# Altium schematic sheet Board.SchDoc: Main MCU
size A3; ApprovedBy: Diogo Gomes; CheckedBy: Bruno, Candido, Pedro; Author: João Vieira; CompanyName: LART; DrawnBy: João Vieira; Organization: LART; Address1: Morro do lena; Address2: Alto Do Vieiro; Address3: APT 4163, Building D; Revision: v1.4.2; SheetNumber: 4; SheetTotal: 12; ProjectTitle: Autonomous Control Unit; CheckedBy1: G. Candido; CheckedBy2: F. Chen; CheckedBy3: P. Ferreira; CheckedBy4: B. Vicente; CheckedBy5: _; CheckedBy6: _; CheckedBy7: _; CHK_APP_DATE: --/--/--; DSN_APP_DATE: --/--/--; ENG_APP_DATE: --/--/--; Summary: The Main Microcontroller that powers the entire ACU; version_tag: 1.4.2; ImagePath: C:\Users\micron\Desktop
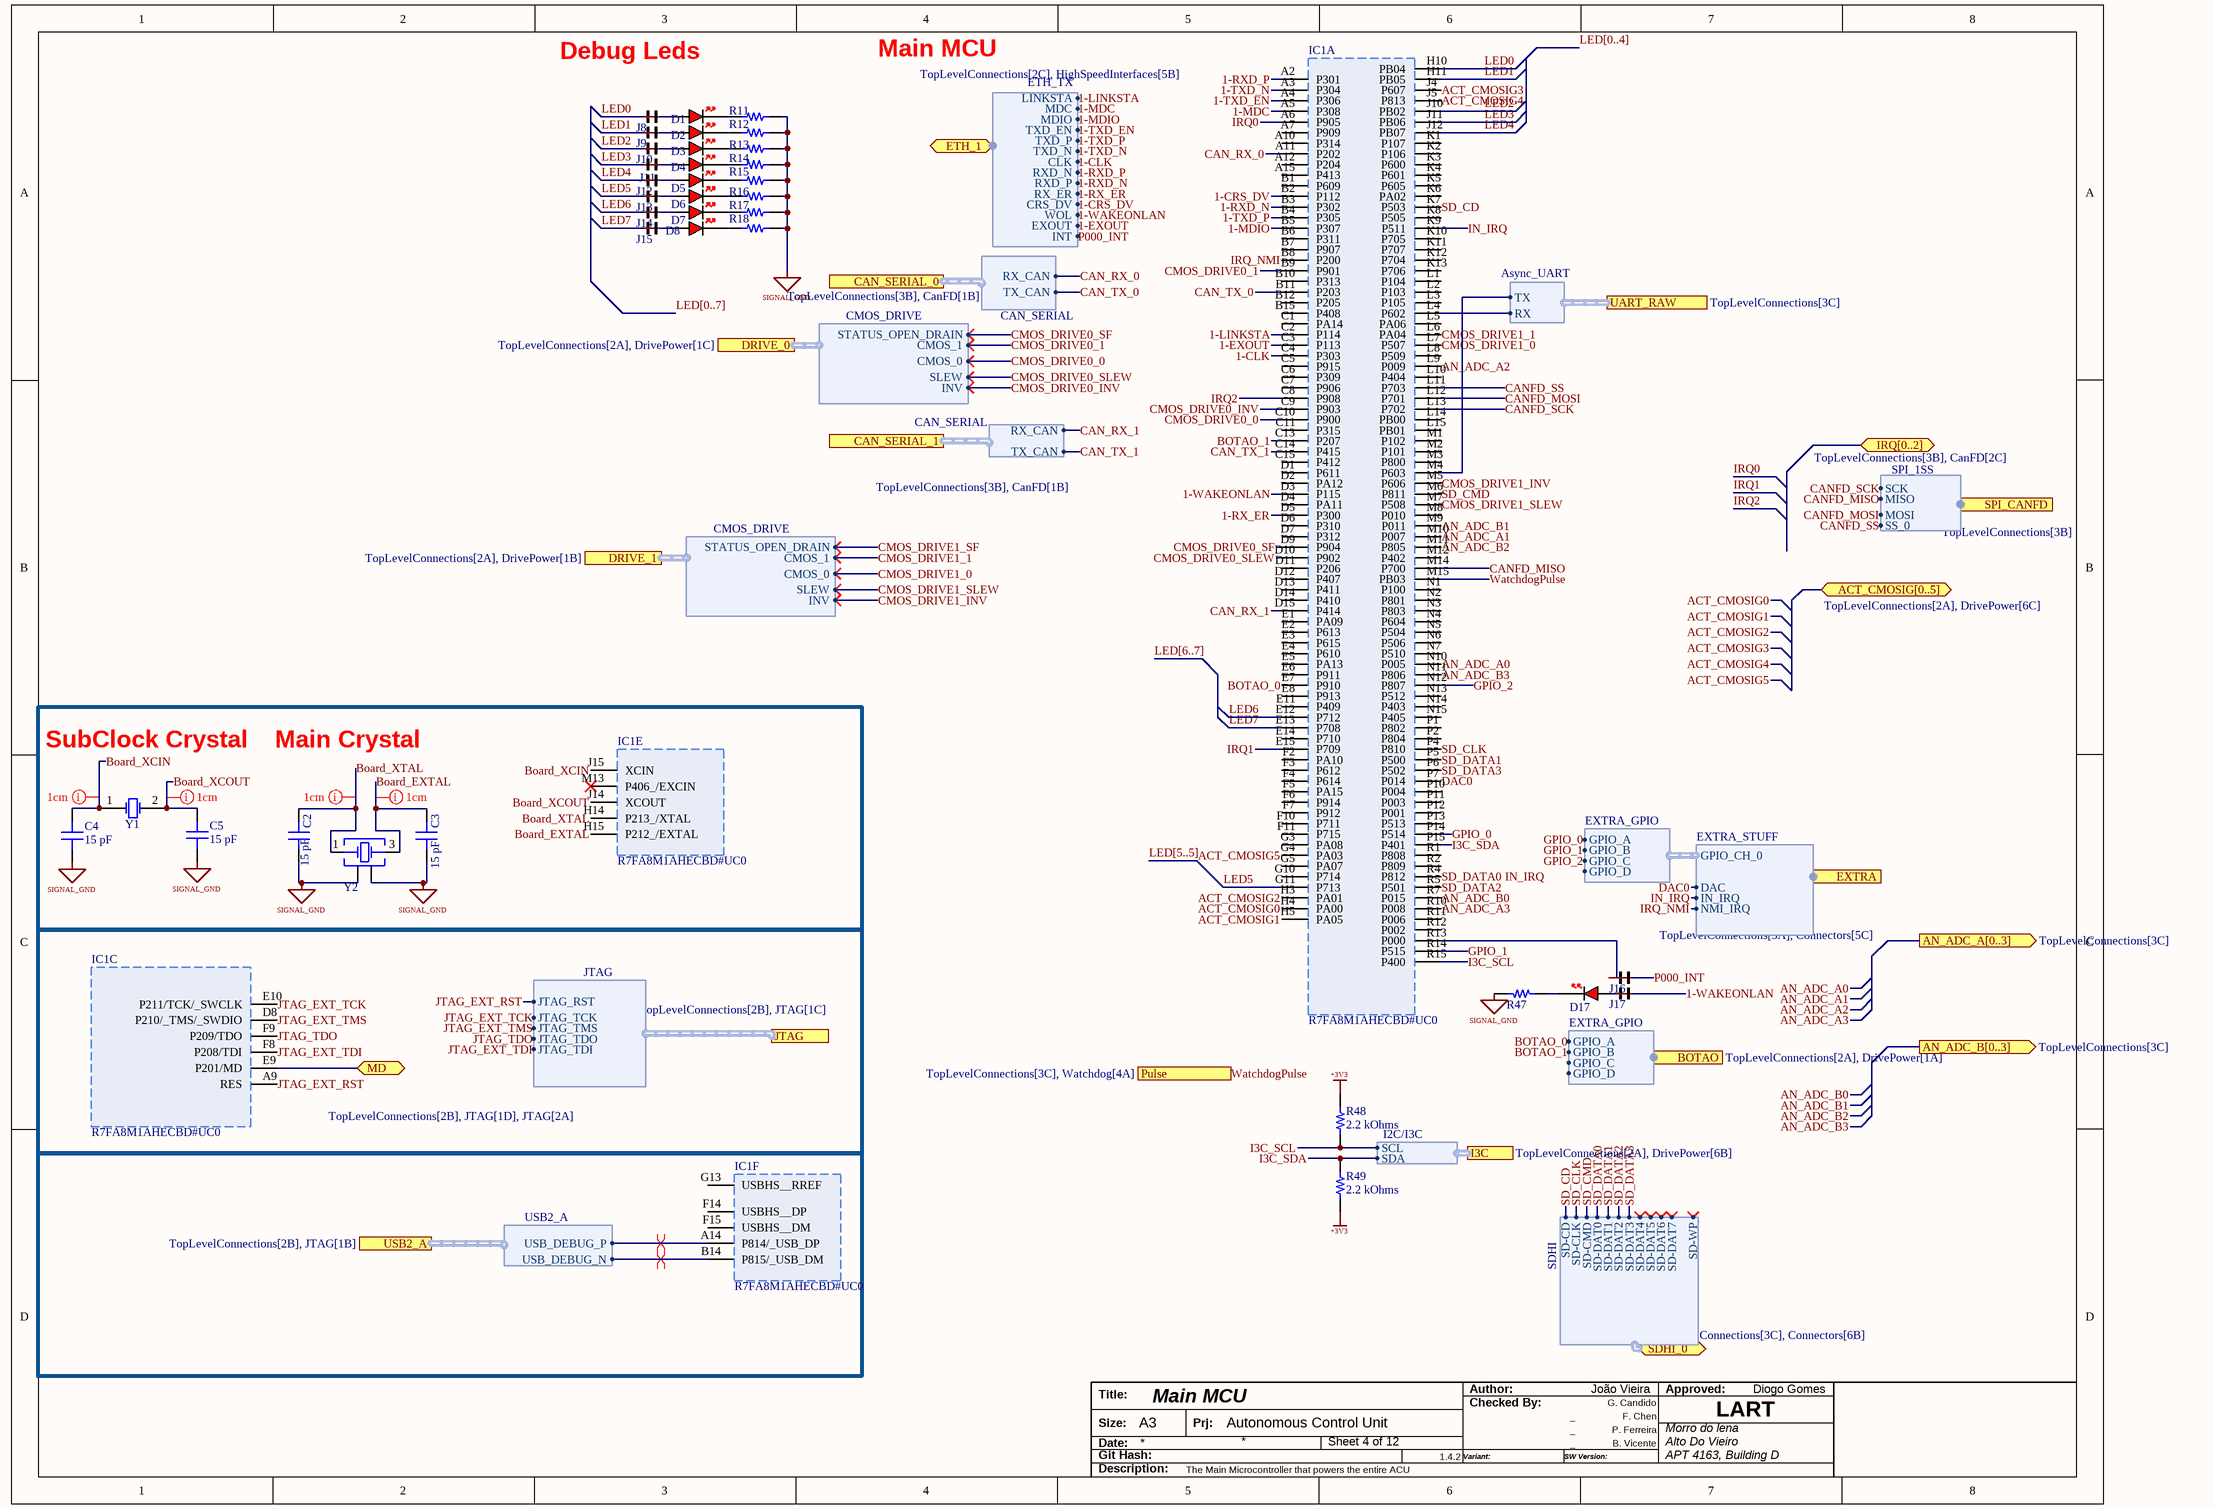
[diagram p0: Board.SchDoc]

## Parts
C2  value 15 pF  [CAP 0805_2012]  (hidden comment: 15pF)
C3  value 15 pF  [CAP 0805_2012]  (hidden comment: 15pF)
C4  value 15 pF  [CAP 0805_2012]  (hidden comment: 15pF)
C5  value 15 pF  [CAP 0805_2012]  (hidden comment: 15pF)
D1  RED  [LED_0603_RED]  (value not drawn)
D2  RED  [LED_0603_RED]  (value not drawn)
D3  RED  [LED_0603_RED]  (value not drawn)
D4  RED  [LED_0603_RED]  (value not drawn)
D5  RED  [LED_0603_RED]  (value not drawn)
D6  RED  [LED_0603_RED]  (value not drawn)
D7  RED  [LED_0603_RED]  (value not drawn)
D8  RED  [LED_0603_RED]  (value not drawn)
D17  RED  [LED_0603_RED]  (value not drawn)
IC1  R7FA8M1AHECBD#UC0  [RA8M1_BGA]  (parts A,C,E,F of 6)
J8  A solder Bridge  [Solder Bridge 805]  (value not drawn)
J9  A solder Bridge  [Solder Bridge 805]  (value not drawn)
J10  A solder Bridge  [Solder Bridge 805]  (value not drawn)
J11  A solder Bridge  [Solder Bridge 805]  (value not drawn)
J12  A solder Bridge  [Solder Bridge 805]  (value not drawn)
J13  A solder Bridge  [Solder Bridge 805]  (value not drawn)
J14  A solder Bridge  [Solder Bridge 805]  (value not drawn)
J15  A solder Bridge  [Solder Bridge 805]  (value not drawn)
J16  A solder Bridge  [Solder Bridge 805]  (value not drawn)
J17  A solder Bridge  [Solder Bridge 805]  (value not drawn)
R11  LEDS  [RES 0805_2012]  (value not drawn)
R12  LEDS  [RES 0805_2012]  (value not drawn)
R13  LEDS  [RES 0805_2012]  (value not drawn)
R14  LEDS  [RES 0805_2012]  (value not drawn)
R15  LEDS  [RES 0805_2012]  (value not drawn)
R16  LEDS  [RES 0805_2012]  (value not drawn)
R17  LEDS  [RES 0805_2012]  (value not drawn)
R18  LEDS  [RES 0805_2012]  (value not drawn)
R47  LEDS  [RES 0805_2012]  (value not drawn)
R48  2.2 kOhms  [RES 0402_1005]
R49  2.2 kOhms  [RES 0402_1005]
Y1  32.768kHz  [WE-XTAL_IQXC-25]  (value not drawn)
Y2  20MHz  [WE-XTAL_CFPX-180]  (value not drawn)

## Ports
ACT_CMOSIG[0..5] (bidir, see TopLevelConnections[2A], DrivePower[6C]), AN_ADC_A[0..3] (out, see TopLevelConnections[3C]), AN_ADC_B[0..3] (out, see TopLevelConnections[3C]), BOTAO (harness EXTRA_GPIO, see TopLevelConnections[2A], DrivePower[1A]), CAN_SERIAL_0 (harness CAN_SERIAL, see TopLevelConnections[3B], CanFD[1B]), CAN_SERIAL_1 (harness CAN_SERIAL, see TopLevelConnections[3B], CanFD[1B]), DRIVE_0 (harness CMOS_DRIVE, see TopLevelConnections[2A], DrivePower[1C]), DRIVE_1 (harness CMOS_DRIVE, see TopLevelConnections[2A], DrivePower[1B]), ETH_1 (bidir, harness ETH_TX, see TopLevelConnections[2C], HighSpeedInterfaces[5B]), EXTRA (harness EXTRA_STUFF, see TopLevelConnections[3A], Connectors[5C]), I3C (harness I2C/I3C, see TopLevelConnections[2A], DrivePower[6B]), IRQ[0..2] (bidir, see TopLevelConnections[3B], CanFD[2C]), JTAG (harness JTAG, see TopLevelConnections[2B], JTAG[1C]), MD (bidir, see TopLevelConnections[2B], JTAG[1D], JTAG[2A]), Pulse (in, see TopLevelConnections[3C], Watchdog[4A]), SDHI_0 (bidir, harness SDHI, see TopLevelConnections[3C], Connectors[6B]), SPI_CANFD (harness SPI_1SS, see TopLevelConnections[3B]), UART_RAW (harness Async_UART, see TopLevelConnections[3C]), USB2_A (harness USB2_A, see TopLevelConnections[2B], JTAG[1B])

## Harnesses
JTAG: JTAG_RST, JTAG_TCK, JTAG_TMS, JTAG_TDO, JTAG_TDI
ETH_TX: MDC, MDIO, TXD_EN, TXD_P, TXD_N, CLK, RXD_N, RXD_P, RX_ER, LINKSTA, CRS_DV, WOL, EXOUT, INT
CAN_SERIAL: RX_CAN, TX_CAN
Async_UART: RX, TX
SDHI: SD-CD, SD-CLK, SD-CMD, SD-DAT0, SD-DAT1, SD-DAT2, SD-DAT3, SD-DAT4, SD-DAT5, SD-DAT6, SD-DAT7, SD-WP
SPI_1SS: MOSI, MISO, SCK, SS_0
USB2_A: USB_DEBUG_N, USB_DEBUG_P
CMOS_DRIVE: CMOS_0, CMOS_1, INV, SLEW, STATUS_OPEN_DRAIN
EXTRA_STUFF: GPIO_CH_0, DAC, IN_IRQ, NMI_IRQ
EXTRA_GPIO: GPIO_A, GPIO_B, GPIO_C, GPIO_D
I2C/I3C: SCL, SDA

## Nets
+3V3: R48.2 R49.1
SIGNAL_GND: C2.1 C3.1 C4.1 C5.1 R11.2 R12.2 R13.2 R14.2 R15.2 R16.2 R17.2 R18.2 R47.2 Y2.2(GND&Lid) Y2.4(GND&Lid)
1-CLK: IC1.C4(P303) ; port ETH_1.CLK
1-CRS_DV: IC1.B2(P112) ; port ETH_1.CRS_DV
1-EXOUT: IC1.C3(P113) ; port ETH_1.EXOUT
1-LINKSTA: IC1.C2(P114) ; port ETH_1.LINKSTA
1-MDC: IC1.A5(P308) ; port ETH_1.MDC
1-MDIO: IC1.B5(P307) ; port ETH_1.MDIO
1-RX_ER: IC1.D5(P300) ; port ETH_1.RX_ER
1-RXD_N: IC1.B3(P302) ; port ETH_1.RXD_P
1-RXD_P: IC1.A2(P301) ; port ETH_1.RXD_N
1-TXD_EN: IC1.A4(P306) ; port ETH_1.TXD_EN
1-TXD_N: IC1.A3(P304) ; port ETH_1.TXD_N
1-TXD_P: IC1.B4(P305) ; port ETH_1.TXD_P
1-WAKEONLAN: IC1.D3(P115) J17.P1 ; port ETH_1.WOL
ACT_CMOSIG0: IC1.H4(PA00)
ACT_CMOSIG1: IC1.H5(PA05)
ACT_CMOSIG2: IC1.H3(PA01)
ACT_CMOSIG3: IC1.J4(P607)
ACT_CMOSIG4: IC1.J5(P813)
ACT_CMOSIG5: IC1.G4(PA03)
AN_ADC_A0: IC1.N10(P005)
AN_ADC_A1: IC1.M10(P007)
AN_ADC_A2: IC1.L9(P009)
AN_ADC_A3: IC1.R10(P008)
AN_ADC_B0: IC1.R7(P015)
AN_ADC_B1: IC1.M9(P011)
AN_ADC_B2: IC1.M11(P805)
AN_ADC_B3: IC1.N11(P806)
Board_EXTAL: C3.2 IC1.H15(P212_/EXTAL) Y2.3(Crystal)
Board_XCIN: C4.2 IC1.J15(XCIN) Y1.1(OSC1)
Board_XCOUT: C5.2 IC1.J14(XCOUT) Y1.2(OSC2)
Board_XTAL: C2.2 IC1.H14(P213_/XTAL) Y2.1(Crystal)
BOTAO_0: IC1.E7(P910) ; port BOTAO.GPIO_A
BOTAO_1: IC1.C13(P207) ; port BOTAO.GPIO_B
CAN_RX_0: IC1.A11(P202) ; port CAN_SERIAL_0.RX_CAN
CAN_RX_1: IC1.D15(P414) ; port CAN_SERIAL_1.RX_CAN
CAN_TX_0: IC1.B11(P203) ; port CAN_SERIAL_0.TX_CAN
CAN_TX_1: IC1.C14(P415) ; port CAN_SERIAL_1.TX_CAN
CANFD_MISO: IC1.M14(P700) ; port SPI_CANFD.MISO
CANFD_MOSI: IC1.L12(P701) ; port SPI_CANFD.MOSI
CANFD_SCK: IC1.L13(P702) ; port SPI_CANFD.SCK
CANFD_SS: IC1.L11(P703) ; port SPI_CANFD.SS_0
CMOS_DRIVE0_0: IC1.C10(P900) ; port DRIVE_0.CMOS_0
CMOS_DRIVE0_1: IC1.B9(P901) ; port DRIVE_0.CMOS_1
CMOS_DRIVE0_INV: IC1.C9(P903) ; port DRIVE_0.INV
CMOS_DRIVE0_SF: IC1.D9(P904) ; port DRIVE_0.STATUS_OPEN_DRAIN
CMOS_DRIVE0_SLEW: IC1.D10(P902) ; port DRIVE_0.SLEW
CMOS_DRIVE1_0: IC1.L7(P507) ; port DRIVE_1.CMOS_0
CMOS_DRIVE1_1: IC1.L6(PA04) ; port DRIVE_1.CMOS_1
CMOS_DRIVE1_INV: IC1.M5(P606) ; port DRIVE_1.INV
CMOS_DRIVE1_SF: port DRIVE_1.STATUS_OPEN_DRAIN
CMOS_DRIVE1_SLEW: IC1.M7(P508) ; port DRIVE_1.SLEW
DAC0: IC1.P7(P014) ; port EXTRA.DAC
GPIO_0: IC1.P14(P514) ; harness EXTRA_GPIO.GPIO_A
GPIO_1: IC1.R14(P515) ; harness EXTRA_GPIO.GPIO_B
GPIO_2: IC1.N12(P807) ; harness EXTRA_GPIO.GPIO_C
I3C_SCL: IC1.R15(P400) R48.1 ; port I3C.SCL
I3C_SDA: IC1.P15(P401) R49.2 ; port I3C.SDA
IN_IRQ: IC1.K9(P511) ; port EXTRA.IN_IRQ
IRQ0: IC1.A6(P905)
IRQ1: IC1.E15(P709)
IRQ2: IC1.C8(P908)
IRQ_NMI: IC1.B8(P200) ; port EXTRA.NMI_IRQ
JTAG_EXT_RST: IC1.A9(RES) ; port JTAG.JTAG_RST
JTAG_EXT_TCK: IC1.E10(P211/TCK/_SWCLK) ; port JTAG.JTAG_TCK
JTAG_EXT_TDI: IC1.F8(P208/TDI) ; port JTAG.JTAG_TDI
JTAG_EXT_TMS: IC1.D8(P210/_TMS/_SWDIO) ; port JTAG.JTAG_TMS
JTAG_TDO: IC1.F9(P209/TDO) ; port JTAG.JTAG_TDO
LED0: IC1.H10(PB04) J8.P0
LED1: IC1.H11(PB05) J9.P0
LED2: IC1.J10(PB02) J10.P0
LED3: IC1.J11(PB06) J11.P1
LED4: IC1.J12(PB07) J12.P0
LED5: IC1.G11(P713) J13.P0
LED6: IC1.E12(P712) J14.P0
LED7: IC1.E13(P708) J15.P0
MD: IC1.E9(P201/MD) ; port MD
P000_INT: J16.P1 ; port ETH_1.INT
SD_CD: IC1.K7(P503) ; port SDHI_0.SD-CD
SD_CLK: IC1.P4(P810) ; port SDHI_0.SD-CLK
SD_CMD: IC1.M6(P811) ; port SDHI_0.SD-CMD
SD_DATA0: IC1.R4(P812) ; port SDHI_0.SD-DAT0
SD_DATA1: IC1.P5(P500) ; port SDHI_0.SD-DAT1
SD_DATA2: IC1.R5(P501) ; port SDHI_0.SD-DAT2
SD_DATA3: IC1.P6(P502) ; port SDHI_0.SD-DAT3
WatchdogPulse: IC1.M15(PB03) ; port Pulse
NetD1_A: D1.A J8.P1
NetD1_K: D1.K R11.1
NetD2_A: D2.A J9.P1
NetD2_K: D2.K R12.1
NetD3_A: D3.A J10.P1
NetD3_K: D3.K R13.1
NetD4_A: D4.A J11.P0
NetD4_K: D4.K R14.1
NetD5_A: D5.A J12.P1
NetD5_K: D5.K R15.1
NetD6_A: D6.A J13.P1
NetD6_K: D6.K R16.1
NetD7_A: D7.A J14.P1
NetD7_K: D7.K R17.1
NetD8_A: D8.A J15.P1
NetD8_K: D8.K R18.1
NetD17_A: D17.A J17.P0
NetD17_K: D17.K R47.1
NetIC1_A14: IC1.A14(P814/_USB_DP) ; port USB2_A.USB_DEBUG_P
NetIC1_B14: IC1.B14(P815/_USB_DM) ; port USB2_A.USB_DEBUG_N
NetIC1_L4: IC1.L4(P602) ; port UART_RAW.RX
NetIC1_M4: IC1.M4(P603) ; port UART_RAW.TX
NetIC1_R13: IC1.R13(P000) J16.P0

Not connected (* = marked no-connect by the designer): IC1 A7(P909) A10(P314) A12(P204) A15(P413) B1(P609) B6(P311) B7(P907) B10(P313) B12(P205) B15(P408) C1(PA14) C5(P915) C6(P309) C7(P906) C11(P315) C15(P412) D1(P611) D2(PA12) D4(PA11) D6(P310) D7(P312) D11(P206) D12(P407) D13(P411) D14(P410) E1(PA09) E2(P613) E3(P615) E4(P610) E5(PA13) E6(P911) E8(P913) E11(P409) E14(P710) F2(PA10) F3(P612) F4(P614) F5(PA15) F6(P914) F7(P912) F10(P711) F11(P715) F14(USBHS__DP) F15(USBHS__DM) G3(PA08) G5(PA07) G10(P714) G13(USBHS__RREF) K1(P107) K2(P106) K3(P600) K4(P601) K5(P605) K6(PA02) K8(P505) K10(P705) K11(P707) K12(P704) K13(P706) L1(P104) L2(P103) L3(P105) L5(PA06) L8(P509) L10(P404) L14(PB00) L15(PB01) M1(P102) M2(P101) M3(P800) M8(P010) M12(P402) M13(P406_/EXCIN)* N1(P100) N2(P801) N3(P803) N4(P604) N5(P504) N6(P506) N7(P510) N13(P512) N14(P403) N15(P405) P1(P802) P2(P804) P10(P004) P11(P003) P12(P001) P13(P513) R1(P808) R2(P809) R11(P006) R12(P002)

## Buses and harness runs
bus LED[0..4]
bus LED[0..7]
bus LED[5..5]
bus LED[6..7]

## Layout directives
differential pair: NetIC1_A14, NetIC1_B14
rule Length Constraint [Min Length = 9.9mm    Max Length = 10.1mm]: Board_EXTAL, Board_XCIN, Board_XCOUT, Board_XTAL

## Notes on the sheet
- Debug Leds
- Main MCU
- SubClock Crystal
- Main Crystal
- Labels drawn without touching a wire or pin: IN_IRQ
- Title:
- Author:
- Checked By:
- Approved:
- Size:
- Date:
- Git Hash:
- A3
- Prj:
- Variant:
- SW Version:
- Description:

## Library data of the parts
C2-C5 = VJ0805D150JXPQJHT: CAP CER 15PF 250V C0G/NP0 0805; manufacturer: Vishay Vitramon; Temperature Coefficient: C0G, NP0; Tolerance: ±5%; Part Number: VJ0805D150JXPQJHT; Applications: RF, Microwave, High Frequency; Capacitance: 15 pF; componentlink1description: Datasheet; componentlink1url: https://www.vishay.com/docs/45239/vjhifreqht.pdf; componentlink2description: DigiKey Link; componentlink2url: https://www.digikey.com/en/products/detail/vishay-vitramon/VJ0805D150JXPQJHT/14292748; Device Package: 0805 (2012 Metric); Features: High Temperature; lastupdated: 04/02/2024 20:15:19; Lifecycle Status: Active; Minimum Order: 1; Mounting Type: Surface Mount, MLCC; Operating Temperature: -55°C ~ 200°C; Package / Case: 0805 (2012 Metric); packaging: TapeAndReel; partid: 31685; Part Status: Active; price: 0.11; series: VJ HIFREQ HT; Size / Dimension: 0.079" L x 0.049" W (2.00mm x 1.25mm); Supplier 1: DigiKey; Supplier Part Number 1: 720-VJ0805D150JXPQJHTCT-ND; Thickness (Max): 0.057" (1.45mm); Voltage - Rated: 250V
D1-D8 D17 = LED_0603_RED: Yellow Plox
IC1 = R7FA8M1AHECBD#UC0: Integrated Circuit; Manufacturer_Name: Renesas Electronics; Datasheet Link: https://www.renesas.com/us/en/document/dst/ra8m1-group-datasheet?r=25447396; Height: 1.47mm; Manufacturer_Part_Number: R7FA8M1AHECBD#UC0; Mouser Part Number: 968-R7FA8M1AHECBDUC0; Mouser Price/Stock: https://www.mouser.co.uk/ProductDetail/Renesas-Electronics/R7FA8M1AHECBDUC0?qs=HoCaDK9Nz5en4LBg9VyLXw%3D%3D
J8-J17 = Solder Bridge 805
R11-R18 R47 = 4-2176091-1: RES SMD 150 OHM 0.1% 1/4W 0805; Manufacturer: TE Connectivity Passive Product; Power (Watts): 0.25W, 1/4W; Resistance: 150 Ohms; Temperature Coefficient: ±25ppm/°C; Part Number: 4-2176091-1; ComponentLink1Description: Datasheet; ComponentLink1URL: https://www.te.com/commerce/DocumentDelivery/DDEController?Action=srchrtrv&DocNm=1773272&DocType=DS&DocLang=English; ComponentLink2Description: DigiKey Link; ComponentLink2URL: https://www.digikey.com/en/products/detail/te-connectivity-passive-product/4-2176091-1/4033932; Composition: Thin Film; Device Package: 0805 (2012 Metric); Height - Seated (Max): 0.026" (0.65mm); LastUpdated: 04/02/2024 21:05:09; Lifecycle Status: Active; Minimum Order: 1; Number of Terminations: 2; Operating Temperature: -55°C ~ 155°C; Package / Case: 0805 (2012 Metric); Packaging: TapeAndReel; PartId: 28504; Part Status: Active; Price: 0.14; Series: RP73P, Holsworthy; Size / Dimension: 0.079" L x 0.049" W (2.00mm x 1.25mm); Supplier 1: DigiKey; Supplier Part Number 1: A110464CT-ND; Supplier Device Package: 0805; Tolerance: ±0.1%
R48 R49 = RR0510P-222-D: RES SMD 2.2K OHM 0.5% 1/16W 0402; Manufacturer: Susumu; Power (Watts): 0.063W, 1/16W; Temperature Coefficient: ±25ppm/°C; Part Number: RR0510P-222-D; Value: 2.2 kOhms; ComponentLink1Description: Datasheet; ComponentLink1URL: http://www.susumu.co.jp/common/pdf/n_catalog_partition05_en.pdf; ComponentLink2Description: DigiKey Link; ComponentLink2URL: https://www.digikey.com/en/products/detail/susumu/RR0510P-222-D/432405; Composition: Thin Film; Device Package: 0402 (1005 Metric); Height - Seated (Max): 0.016" (0.40mm); LastUpdated: 09/02/2024 20:30:21; Lifecycle Status: Active; Minimum Order: 1; Number of Terminations: 2; Operating Temperature: -55°C ~ 125°C; Package / Case: 0402 (1005 Metric); Packaging: TapeAndReel; PartId: 3229; Part Status: Active; Price: 0.01; Resistance: 2.2 kOhms; Series: RR; Size / Dimension: 0.039" L x 0.020" W (1.00mm x 0.50mm); Supplier 1: DigiKey; Supplier Part Number 1: RR05P2.2KDCT-ND; Tolerance: ±0.5%
Y1 = 830062558: WE-XTAL Watch Crystal, SMT, IQXC-25, 32.768kHz, +/-10ppm; Manufacturer: Wurth Elektronik; Load Capacitance: 9pF; ComponentLink1Description: Website Link; ComponentLink1URL: https://www.we-online.com/redexpert/article/830062558?ad; ComponentLink2Description: Datasheet Link; ComponentLink2URL: https://www.we-online.com/redexpert/spec/830062558?ad; Manufacturer Part Number: 830062558; Category: Crystals; Match Code: WE-XTAL; Mount: Surface Mount; Operating Temperature Max: 85°C; Operating Temperature Min: -40°C; Packaging: Tape and Reel; Case/Size Code: IQXC-25; Length: 2mm; Width: 1.2mm; Height: 0.6mm; Frequency: 32.768kHz; Frequency Tolerance: +/-10ppm
Y2 = 830108207209: WE-XTAL Quartz Crystal, SMT, CFPX-180, 20MHz, +/-10ppm; Manufacturer: Wurth Elektronik; Frequency Stability: +/-20ppm; Load Capacitance: 8pF; ComponentLink1Description: Website Link; ComponentLink1URL: https://www.we-online.com/redexpert/article/830108207209?ad; ComponentLink2Description: Datasheet Link; ComponentLink2URL: https://www.we-online.com/redexpert/spec/830108207209?ad; Manufacturer Part Number: 830108207209; Category: Crystals; Match Code: WE-XTAL; Mount: Surface Mount; Operating Temperature Max: 85°C; Operating Temperature Min: -40°C; Packaging: Tape and Reel; Case/Size Code: CFPX-180; Length: 3.4mm; Width: 2.7mm; Height: 0.8mm; Frequency: 20MHz; Frequency Tolerance: +/-10ppm